# EAGLE design bbf-eurojacks (EAGLE 9.6.2)
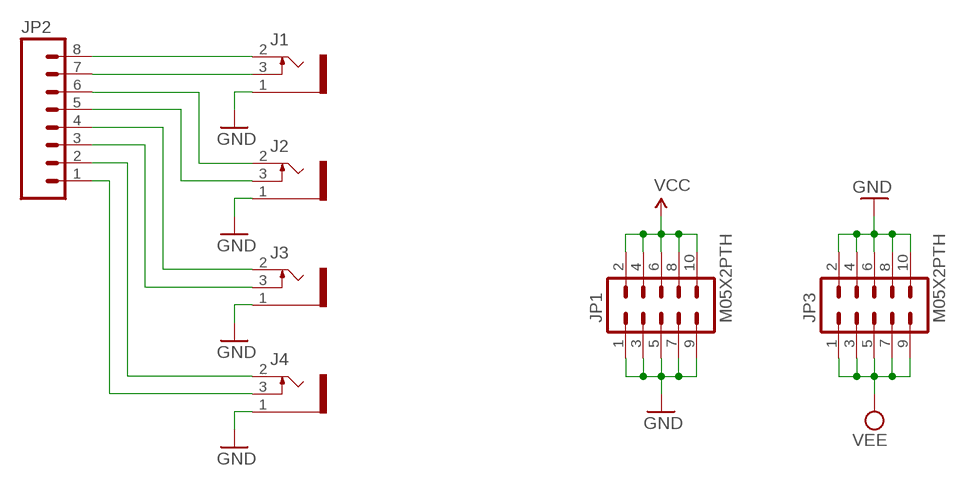
[diagram p0: schematic, sheet 1]

## Parts
J1  1502_03SLOTTED  [1502_03_SLOTTED]
J2  1502_03SLOTTED  [1502_03_SLOTTED]
J3  1502_03SLOTTED  [1502_03_SLOTTED]
J4  1502_03SLOTTED  [1502_03_SLOTTED]
JP1  M05X2PTH  [AVR_ICSP]
JP2  M08  [1X08]
JP3  M05X2PTH  [AVR_ICSP]

## Nets
GND: J1.1 J2.1 J3.1 J4.1 JP1.1 JP1.3 JP1.5 JP1.7 JP1.9 JP3.2 JP3.4 JP3.6 JP3.8 JP3.10
N$1: J2.2 JP2.6
N$2: J2.3 JP2.5
N$3: J3.2 JP2.4
N$4: J3.3 JP2.3
N$5: J4.2 JP2.2
N$6: J4.3 JP2.1
N$7: J1.2 JP2.8
N$8: J1.3 JP2.7
VCC: JP1.2 JP1.4 JP1.6 JP1.8 JP1.10
VEE: JP3.1 JP3.3 JP3.5 JP3.7 JP3.9

## Library data of the parts
J1-J4 = og-lumberg:1502_03
JP1 JP3 = SparkFun:M05X2: Header 5x2 Standard 10-pin dual row 0.1" header. Commonly used with AVR-ISP. Use with Spark Fun Electronics SKU: PRT-00778
JP2 = SparkFun:M08: Header 8 Standard 8-pin 0.1" header. Use with straight break away headers (SKU : PRT-00116), right angle break away headers (PRT-00553), swiss pins (PRT-00743), machine pins (PRT-00117), and female headers (PRT-00115).

## Board
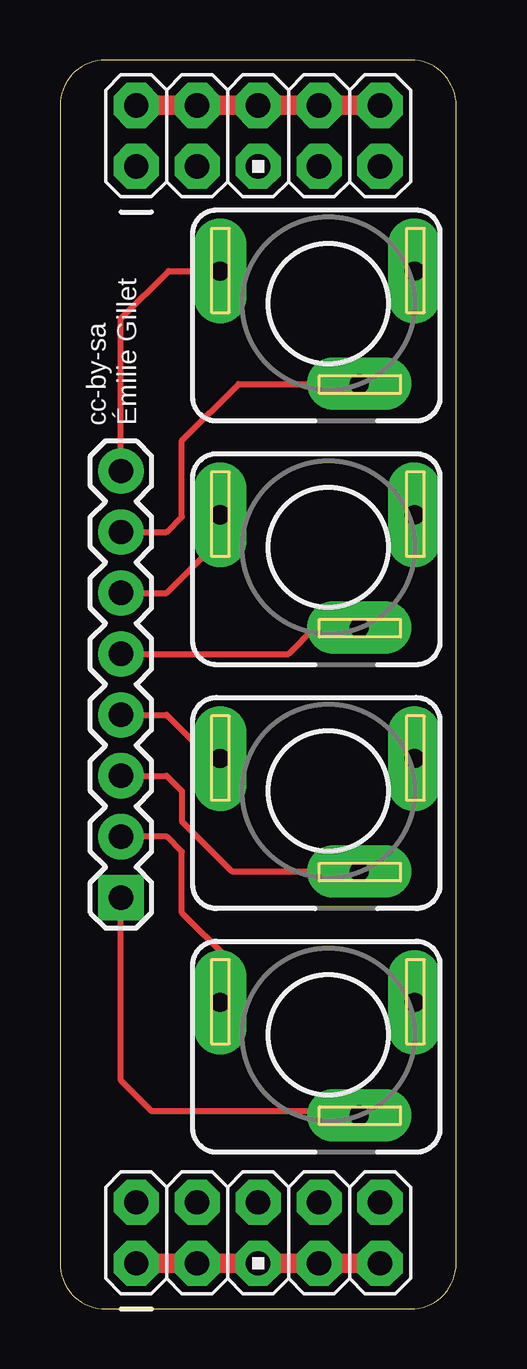
[diagram p1: board, top side]
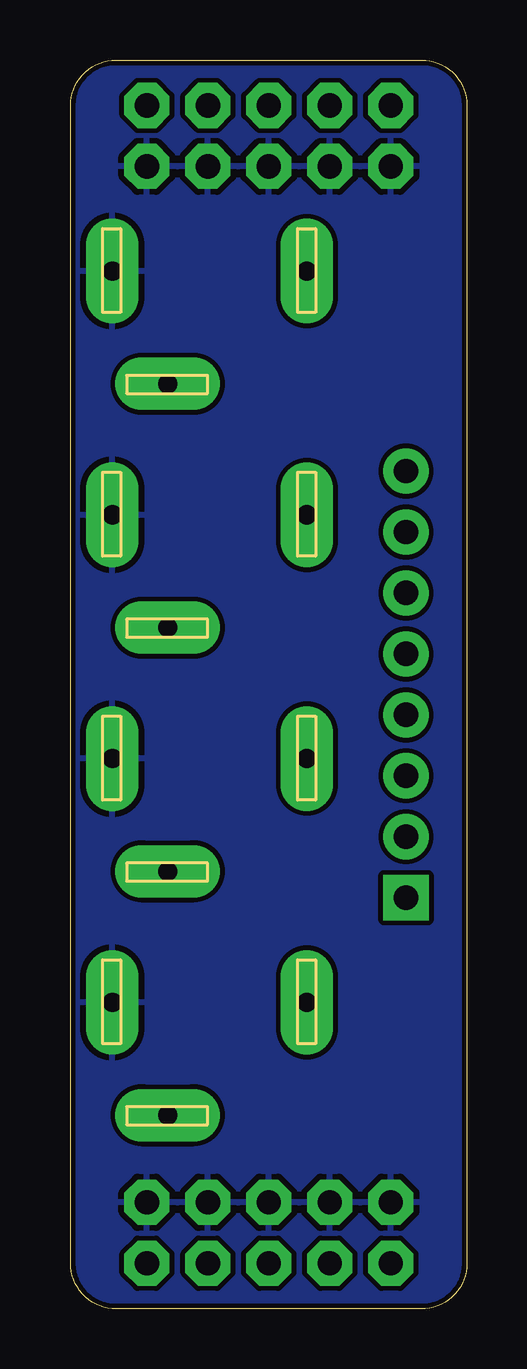
[diagram p2: board, bottom side, seen from below]

Size 16.51 x 52.06 mm. Coordinates in mm from the lower left corner, seen from the top.
Outline: 14.61,0 arc90 16.51,1.91 16.51,50.16 arc90 14.62,52.06 1.89,52.06 arc90 0,50.16 0,1.91 arc90 1.91,0 14.61,0
Copper layers (1*16): Top 0.035mm / dielectric 1.5mm / Bottom 0.035mm
Design rules "SparkFun_10mil *": minimum track width 8mil, minimum drill 20mil, track to track 8mil, track to pad 8mil, pad to pad 8mil, via to via 8mil, smd to smd 8mil, copper to edge 8mil, drill to drill 8mil, minimum pad ring 12mil, minimum via ring 10mil, stop-mask expansion 4mil, vias tented up to drill 25mil, thermal gap 10mil

### Footprints (pad centres in the part's own frame; a part is rotated, then mirrored left to right if it is on the bottom)
1502_03_SLOTTED = drill 0.8 pad 2.184 long: 1 1.35,-3.34; 2 1.35,4.76; 3 -3.35,-1.04
AVR_ICSP = drill 1.016 pad 1.88 octagon: 1 -1.27,5.08; 2 1.27,5.08; 3 -1.27,2.54; 4 1.27,2.54; 5 -1.27,0; 6 1.27,0; 7 -1.27,-2.54; 8 1.27,-2.54; 9 -1.27,-5.08; 10 1.27,-5.08
1X08 = drill 1.016 pad 1.88 square: 1 0,0 | drill 1.016 pad 1.88: 2 2.54,0; 3 5.08,0; 4 7.62,0; 5 10.16,0; 6 12.7,0; 7 15.24,0; 8 17.78,0

### Placement (x,y rotation side)
J1  11.43,41.91 90 top
J2  11.43,31.75 90 top
J3  11.43,21.59 90 top
J4  11.43,11.43 90 top
JP1  8.26,48.9 90 top
JP2  2.54,17.15 90 top
JP3  8.26,3.18 90 top

### Tracks (layer width: path | path; a pad name or v marks a point on that pad's centre or on a via)
GND
  pour Bottom: 14.61,0 arc90 16.51,1.91 16.51,50.16 arc90 14.61,52.07 1.91,52.07 arc90 0,50.16 0,1.91 arc90 1.91,0
N$1
  Top 0.254: JP2.6 4.45,29.84 6.67,32.07 J2.2
N$2
  Top 0.254: JP2.5 9.53,27.3 10.62,28.4 J2.3
N$3
  Top 0.254: JP2.4 4.45,24.77 6.27,22.94 J3.2
N$4
  Top 0.254: JP2.3 4.45,22.23 5.08,21.59 5.08,20.32 7.16,18.24 J3.3
N$5
  Top 0.254: J4.2 6.98,13.09 6.98,14.61 5.08,16.51 5.08,19.05 4.45,19.69 JP2.2
N$6
  Top 0.254: JP2.1 2.54,9.52 3.81,8.26 10.79,8.26 10.97,8.08 J4.3
N$7
  Top 0.254: JP2.8 2.54,41.27 4.53,43.26 J1.2
N$8
  Top 0.254: JP2.7 4.45,32.38 5.08,33.02 5.08,36.2 7.45,38.56 J1.3
VCC
  Top 0.813: JP1.2 JP1.4 JP1.6 JP1.8 JP1.10
VEE
  Top 0.813: JP3.1 JP3.3 JP3.5 JP3.7 JP3.9

### Text on the board
tNames: cc-by-sa | Émilie Gillet